# EAGLE design av_amp_02 (EAGLE 9.4.2)
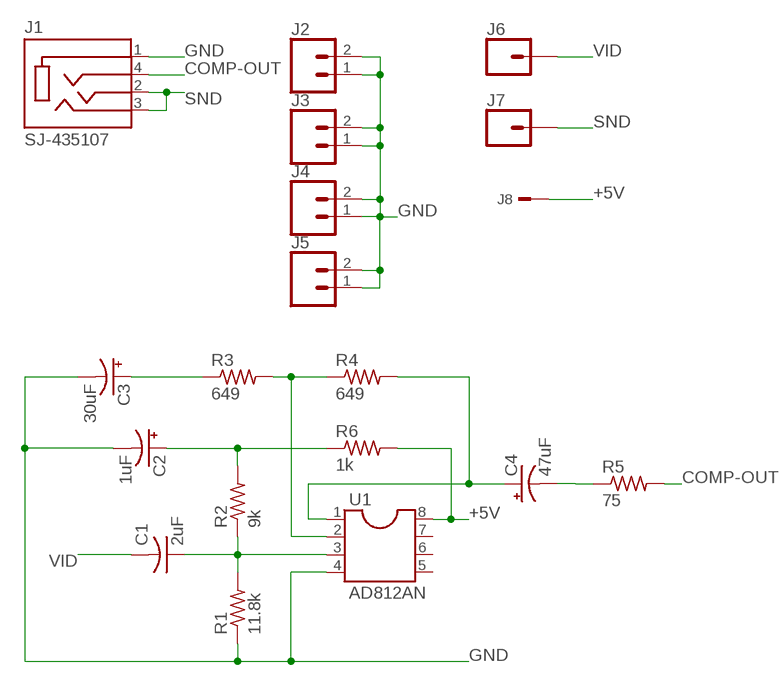
[diagram p0: schematic, sheet 1]

## Parts
C1  2uF  C-US225-087X268  [C225-087X268]
C2  1uF  CPOL-USE5-5  [E5-5]
C3  30uF  CPOL-USE5-10.5  [E5-10,5]
C4  47uF  CPOL-USE5-6  [E5-6]
J1  SJ-435107  [CUI_SJ-435107]
J2  CONN_02  [1X02]
J3  CONN_02  [1X02]
J4  CONN_02  [1X02]
J5  CONN_02  [1X02]
J6  CONN_01  [1X01]
J7  CONN_01  [1X01]
J8  TSW-101-08-G-S-S-RA  [TSW-101-08-G-S-RA]
R1  11.8k  R-US_0207/10  [0207/10]
R2  9k  R-US_0207/10  [0207/10]
R3  649  R-US_0207/10  [0207/10]
R4  649  R-US_0207/10  [0207/10]
R5  75  R-US_0207/10  [0207/10]
R6  1k  R-US_0207/10  [0207/10]
U1  AD812AN  DIL8  [DIL08]

## Nets
+5V [power]: J8.1 R6.2 U1.8
COMP-OUT: J1.4(RING2) R5.2
GND [power]: C2.- C3.- J1.1(SLEEVE) J2.1 J2.2 J3.1 J3.2 J4.1 J4.2 J5.1 J5.2 R1.1 U1.4
N$1: C3.+ R3.1
N$2: R3.2 R4.1 U1.2
N$3: C1.1 R1.2 R2.1 U1.3
N$4: C4.+ R4.2 U1.1
N$5: C4.- R5.1
N$6: C2.+ R2.2 R6.1
SND: J1.2(TIP) J1.3(RING1) J7.1
VID: C1.2 J6.1
Unconnected: U1.5 U1.6 U1.7

## Library data of the parts
C1 = rcl:C-US: CAPACITOR, American symbol; SPICEPREFIX: C
C2-C4 = rcl:CPOL-US: POLARIZED CAPACITOR, American symbol; SPICEPREFIX: C
J1 = SJ-435107:SJ-435107: Female 4C/4C Shielded Through Hole Right Angle 3.5 mm Audio Jack; AVAILABILITY: Good; DESCRIPTION: Female 4C/4C Shielded Through Hole Right Angle 3.5 mm Audio Jack; MF: CUI; MP: SJ-435107; PACKAGE: None; PRICE: 0.98 USD
J2-J5 = SparkFun-Connectors:CONN_02: Multi connection point. Often used as Generic Header-pin footprint for 0.1 inch spaced/style header connections On any of the 0.1 inch spaced packages, you can populate with these: Break Away Headers - Straight <https://www.sparkfun.com/products/116> (PRT-00116) Break Away Male Headers - Right Angle <https://www.sparkfun.com/products/553> (PRT-00553) Female Headers <https://www.sparkfun.com/products/115> (PRT-00115) Break Away Headers - Machine Pin <https://www.sparkfun.com/products/117> (PRT-00117) Break Away Female Headers - Swiss Machine Pin <https://www.sparkfun.com/products/743> (PRT-00743) For SCREWTERMINALS and SPRING TERMINALS visit here: Screw Terimnals on SparkFun.com <https://www.sparkfun.com/search/results?term=Screw+Terminals> (5mm/3.5mm/2.54mm spacing) This device is also useful as a general connection point to wire up your design to another part of your project. Our various solder wires solder well into these plated through hole pads. Hook-Up Wire - Assortment (Stranded, 22 AWG) <https://www.sparkfun.com/products/11375> (PRT-11375) Hook-Up Wire - Assortment (Solid Core, 22 AWG) <https://www.sparkfun.com/products/11367> (PRT-11367) View the entire wire category on our website here <https://www.sparkfun.com/categories/141> Special notes: Molex polarized connector foot print use with: PRT-08233 with associated crimp pins and housings. 2.54_SCREWTERM for use with PRT-10571. 3.5mm Screw Terminal footprints for PRT-08084 5mm Screw Terminal footprints for use with PRT-08432
J6 J7 = SparkFun-Connectors:CONN_01: Single connection point. Often used as Generic Header-pin footprint for 0.1 inch spaced/style header connections On any of the 0.1 inch spaced packages, you can populate with these: Break Away Headers - Straight <https://www.sparkfun.com/products/116> (PRT-00116) Break Away Male Headers - Right Angle <https://www.sparkfun.com/products/553> (PRT-00553) Female Headers <https://www.sparkfun.com/products/115> (PRT-00115) Break Away Headers - Machine Pin <https://www.sparkfun.com/products/117> (PRT-00117) Break Away Female Headers - Swiss Machine Pin <https://www.sparkfun.com/products/743> (PRT-00743) This device is also useful as a general connection point to wire up your design to another part of your project. Our various solder wires solder well into these plated through hole pads. Hook-Up Wire - Assortment (Stranded, 22 AWG) <https://www.sparkfun.com/products/11375> (PRT-11375) Hook-Up Wire - Assortment (Solid Core, 22 AWG) <https://www.sparkfun.com/products/11367> (PRT-11367) View the entire wire category on our website here <https://www.sparkfun.com/categories/141> Special notes: SMTSO-256-ET is a "flush mount" nut for a 4-40 screw. We mostly use this on specialty testbeds; it is a nice way to connect hardware to your PCB at an adjustable hieght. Also note, the SNAP packages are for using a snappable style connector. We sell a baggie of snaps and they are also used on two LilyPad designs: Snap Assortment - 30 pack (male and female) <https://www.sparkfun.com/products/11347> (DEV-11347) LilyPad Arduino SimpleSnap <https://www.sparkfun.com/products/10941> (DEV-10941) LilyPad SimpleSnap Protoboard <https://www.sparkfun.com/products/10940> (DEV-10940)
J8 = con-samtec:TSW-101-*-G-S: THROUGH-HOLE .025" SQ POST HEADER Source: Samtec TSW.pdf; MF: Samtec Inc.; MPN: TSW-101-08-G-S-RA
R1-R6 = resistor:R-US_: RESISTOR, American symbol
U1 = ic-package:DIL8: Dual In Line / Socket

## Net classes
1 power: width 0.381 mm, drill 0.254 mm, clearance 0.254 mm

## Board
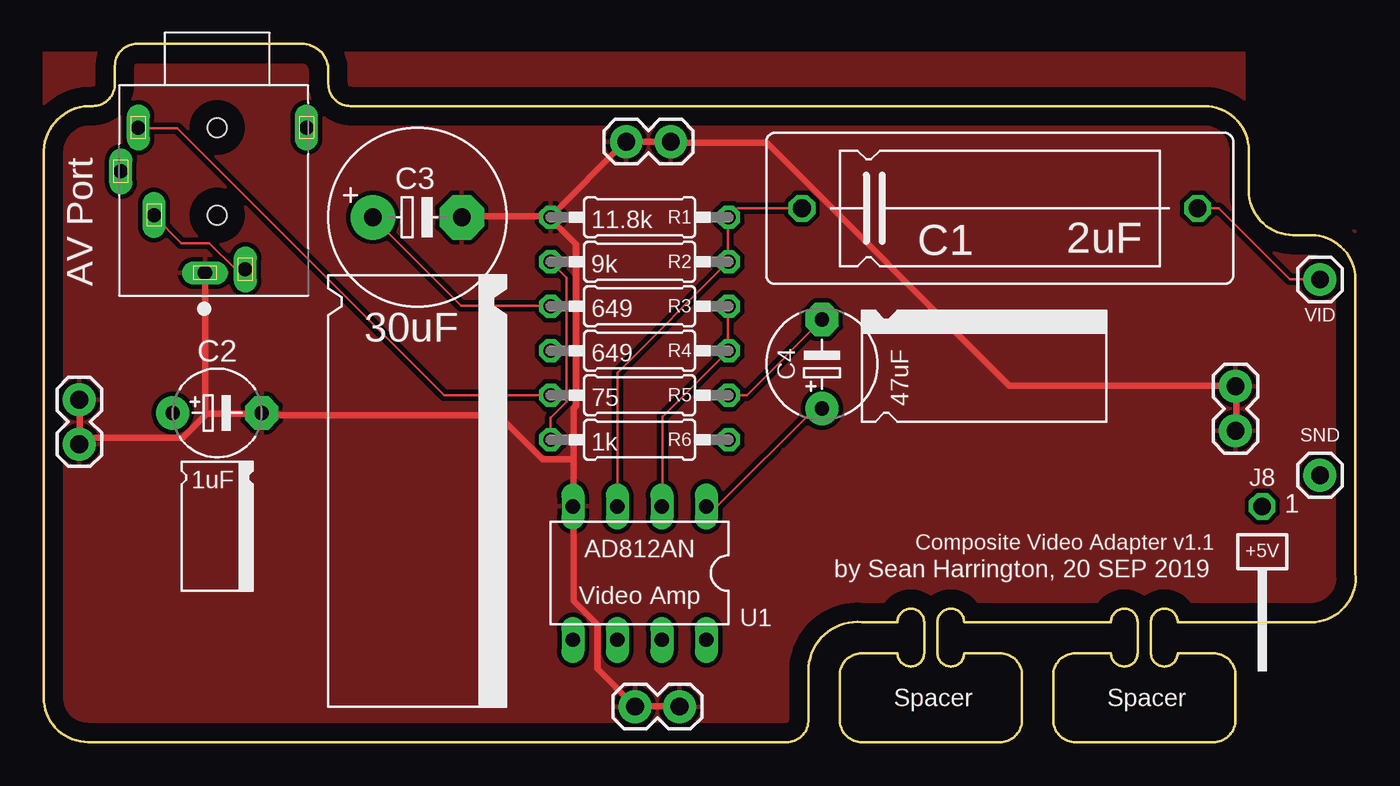
[diagram p1: board, top side]
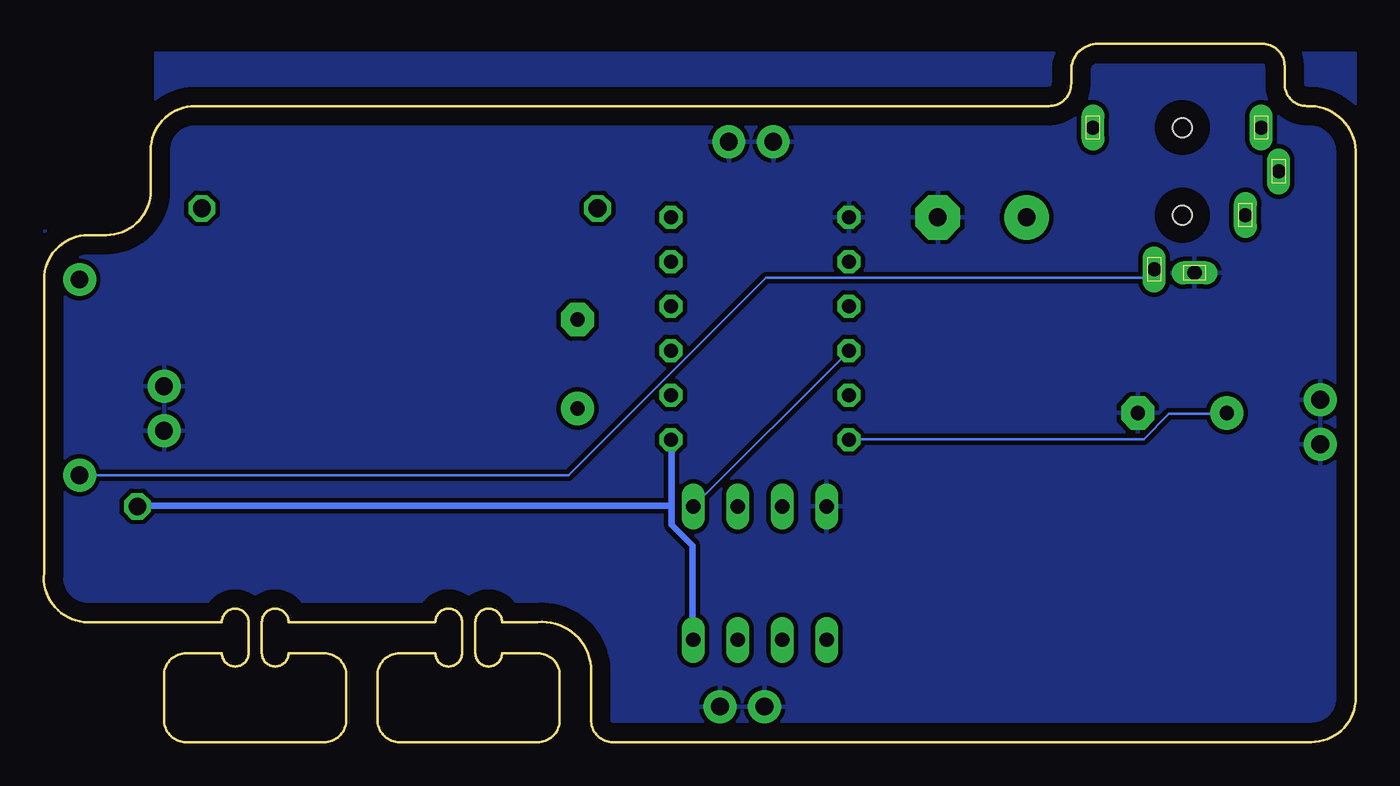
[diagram p2: board, bottom side, seen from below]

Size 74.94 x 39.88 mm. Coordinates in mm from the lower left corner, seen from the top.
Outline: 74.93,9.65 74.93,26.42 arc90 72.39,28.96 71.37,28.96 arc-90 68.83,31.5 68.83,33.78 arc90 66.29,36.32 17.53,36.32 arc-90 16.26,37.59 16.26,38.35 arc90 14.73,39.88 5.33,39.88 arc90 4.06,38.61 4.06,37.59 arc-90 2.79,36.32 arc90 0,33.78 0,2.54 arc90 2.54,0 42.42,0 arc90 43.69,1.27 43.69,3.81 43.69,4.32 arc-90 46.74,6.86 48.77,6.86 arc-180 50.29,6.86 50.29,5.08 arc-180 48.77,5.08 46.74,5.08 arc90 45.47,3.81 45.47,1.52 45.47,1.27 arc90 46.74,0 54.61,0 arc90 55.88,1.27 55.88,3.81 arc90 54.61,5.08 52.58,5.08 arc-180 51.05,5.08 51.05,6.86 arc-180 52.58,6.86 60.96,6.86 arc-180 62.48,6.86 62.48,5.08 arc-180 60.96,5.08 58.93,5.08 arc90 57.66,3.81 57.66,1.27 arc90 58.93,0 66.8,0 arc90 68.07,1.27 68.07,3.81 arc90 66.8,5.08 64.77,5.08 arc-180 63.25,5.08 63.25,6.86 arc-180 64.77,6.86 71.37,6.86 72.64,6.86 arc90 74.93,9.65
Copper layers (1*16): Top 0.035mm / dielectric 1.5mm / Bottom 0.035mm
Design rules "default": minimum track width 6mil, minimum drill 0.35mm, track to track 6mil, track to pad 6mil, pad to pad 6mil, via to via 6mil, smd to smd 6mil, copper to edge 40mil, drill to drill 6mil, minimum pad ring 10mil, minimum via ring 8mil, stop-mask expansion 4mil, vias tented up to drill 0mil, thermal gap 10mil

### Footprints (pad centres in the part's own frame; a part is rotated, then mirrored left to right if it is on the bottom)
C225-087X268 = drill 1.016 octagon: 1 -11.303,0; 2 11.303,0
E5-5 = drill 0.813 pad 1.905: + -2.54,0 | drill 0.813 pad 1.905 octagon: - 2.54,0
E5-10,5 = drill 1.016 pad 2.54: + -2.54,0 | drill 1.016 pad 2.54 octagon: - 2.54,0
E5-6 = drill 0.813 pad 1.905: + -2.54,0 | drill 0.813 pad 1.905 octagon: - 2.54,0
CUI_SJ-435107 = drill 0.8 pad 1.1 long: 1 4.7,-0.7; 2 1.4,-3.6; 3 4.5,1.6; 4 -3.6,-4.5; SH1 -3.6,5.1; SH2 -1.1,-5.5 | hole 1.1: -3.6,0; 1.4,0
1X02 = drill 1.016 pad 1.88: 1 0,0; 2 2.54,0
1X01 = drill 1.016 pad 1.88: 1 0,0
TSW-101-08-G-S-RA = drill 1 pad 1.5 octagon: 1 0,1.524
0207/10 = drill 0.813 octagon: 1 -5.08,0; 2 5.08,0
DIL08 = drill 0.813 long: 1 -3.81,-3.81; 2 -1.27,-3.81; 3 1.27,-3.81; 4 3.81,-3.81; 5 3.81,3.81; 6 1.27,3.81; 7 -1.27,3.81; 8 -3.81,3.81

### Placement (x,y rotation side)
C1  54.61,30.48 0 top
C2  9.91,18.8 0 top
C3  21.34,29.97 0 top
C4  44.45,21.59 90 top
J1  9.91,31.5 270 top
J2  33.27,34.29 0 top
J3  33.78,2.03 0 top
J4  2.03,17.02 90 top
J5  68.07,17.78 90 top
J6  72.9,26.42 0 top
J7  72.9,15.24 0 top
J8  69.6,11.94 0 top
R1  34.04,29.97 0 top
R2  34.04,27.43 180 top
R3  34.04,24.89 0 top
R4  34.04,22.35 180 top
R5  34.04,19.81 180 top
R6  34.04,17.27 0 top
U1  34.04,9.65 180 top

### Tracks (layer width: path | path; a pad name or v marks a point on that pad's centre or on a via)
+5V
  Bottom 0.381: 39.09,13.49 39.09,17.22 R6.2 | 39.09,13.49 39.09,12.42 37.87,11.2 37.87,5.87 U1.8 | J8.1 69.57,13.49 39.24,13.49 39.09,13.49
COMP-OUT
  Top 0.152: R5.2 22.86,19.81 7.62,35.05 5.41,35.05 J1.4
GND
  Top 0.381: 2.06,19.58 J4.2 2.06,19.43 2.06,17.07 J4.1 2.21,17.37 7.92,17.37 9.3,18.75 | 9.3,18.75 12.42,18.75 C2.- 12.57,18.67 25.98,18.67 28.5,16.15 30.1,16.15 30.25,16.15 | J3.2 36.27,2.06 33.91,2.06 J3.1 33.76,2.06 31.62,4.19 31.62,6.71 30.25,8.08 30.25,13.41 U1.4 30.25,13.64 30.25,16.15 | J5.1 68.12,17.83 68.12,20.27 J5.2 67.89,20.34 55.17,20.34 41.3,34.21 35.97,34.21 J2.2 33.3,34.29 J2.1 33.15,34.21 29.03,30.1 R1.1 | R1.1 28.96,30.02 23.93,30.02 C3.- | 30.25,16.15 30.25,19.05 30.4,19.2 30.4,28.42 29.03,29.79 R1.1 | J1.1 9.22,26.75 9.22,18.9 9.3,18.75
  pour Top: 0,39.37 68.58,39.37 68.58,30.48 69.85,29.21 74.93,29.21 74.93,7.62 45.72,7.62 43.18,5.08 43.18,0 0,0
  pour Bottom: 0,39.37 68.58,39.37 68.58,30.48 69.85,29.21 74.93,29.21 74.93,7.62 45.72,7.62 43.18,5.08 43.18,0 0,0
LOGO
  pour Top: 42.16,16.76 39.62,12.19 43.94,12.19 44.7,11.18 49.78,11.18 49.78,12.19 62.23,12.19 62.99,11.68 64.77,11.68 66.29,13.46 66.29,16.76 48.51,16.76 47.5,17.27 44.7,17.27 43.69,16.76
N$1
  Top 0.152: R3.1 28.96,24.92 23.85,24.92 18.82,29.95 C3.+
N$2
  Top 0.152: U1.2 35.36,13.49 35.36,18.59 39.09,22.33 R4.1 39.09,22.4 39.09,24.84 R3.2
N$3
  Top 0.152: 39.09,27.43 32.77,21.11 32.77,13.49 U1.3 | 39.09,27.43 R2.1 39.09,27.43 | 39.09,27.43 39.09,29.95 R1.2 39.17,30.02 39.62,30.48 43.28,30.48 C1.1
N$4
  Top 0.152: U1.1 37.87,13.49 38.48,13.49 44.04,19.05 44.42,19.05 C4.+
  Bottom 0.152: R4.2 28.96,22.33 37.8,13.49 U1.1
N$5
  Top 0.152: R5.1 39.17,19.81 40.16,19.81 44.42,24.08 C4.-
N$6
  Top 0.152: R2.2 29.87,26.52 29.87,19.43 28.96,18.52 28.96,17.3 R6.1
  Bottom 0.152: C2.+ 7.39,18.75 10.67,18.75 12.12,17.3 28.96,17.3 R6.1
SND
  Top 0.152: J1.3 11.43,27.05 10.9,27.05 9.45,28.5 7.85,28.5 6.33,30.02 J1.2
  Bottom 0.152: J7.1 72.85,15.24 44.96,15.24 33.68,26.52 11.96,26.52 11.51,26.98 J1.3
VID
  Top 0.152: C1.2 67.13,30.48 71.17,26.44 72.85,26.44 J6.1

### Text on the board
tPlace: AV Port | VID | SND | Composite Video Adapter v1.1 | +5V | by Sean Harrington, 20 SEP 2019 | Video Amp | Spacer | Spacer